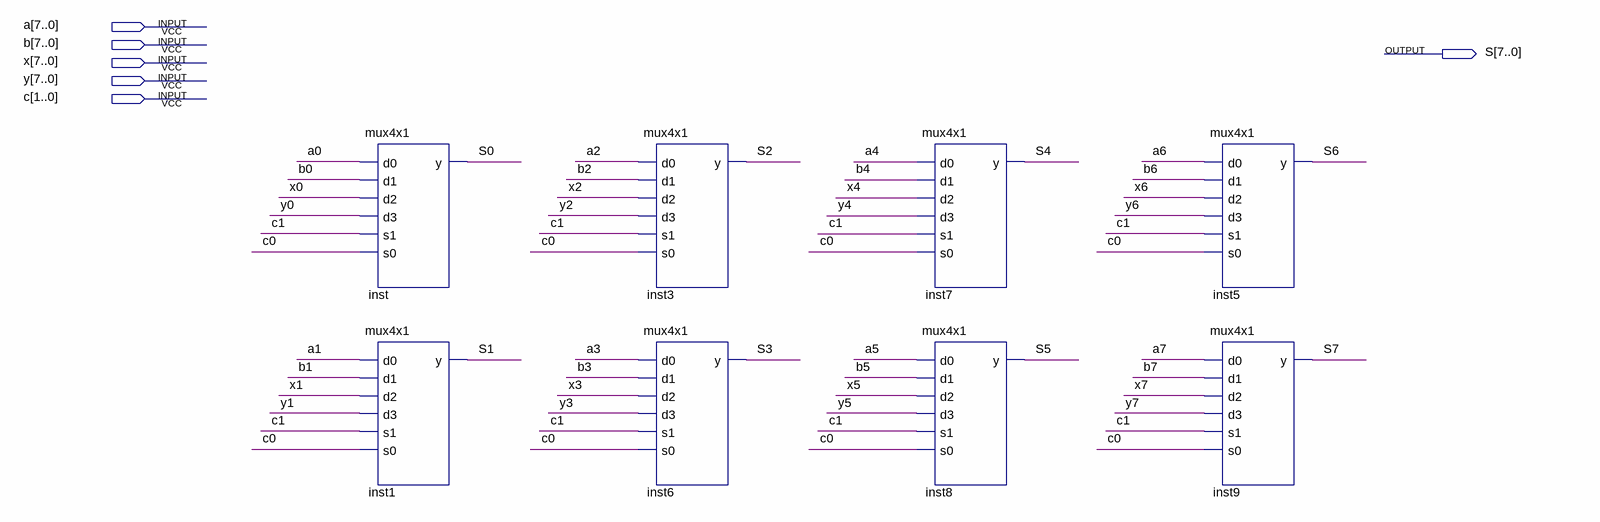
[diagram p0: schematic sheet]
// Quartus schematic mux4x1_8bits.bdf as structural Verilog: 8 symbols, 6 pins
module mux4x1_8bits (
  input  [7:0] a,
  input  [7:0] b,
  input  [7:0] x,
  input  [7:0] y,
  input  [1:0] c,
  output [7:0] S
);

  mux4x1 inst (.d0(a[0]), .d1(b[0]), .d2(x[0]), .d3(y[0]), .s1(c[1]), .s0(c[0]), .y(S[0]));
  mux4x1 inst1 (.d0(a[1]), .d1(b[1]), .d2(x[1]), .d3(y[1]), .s1(c[1]), .s0(c[0]), .y(S[1]));
  mux4x1 inst3 (.d0(a[2]), .d1(b[2]), .d2(x[2]), .d3(y[2]), .s1(c[1]), .s0(c[0]), .y(S[2]));
  mux4x1 inst6 (.d0(a[3]), .d1(b[3]), .d2(x[3]), .d3(y[3]), .s1(c[1]), .s0(c[0]), .y(S[3]));
  mux4x1 inst7 (.d0(a[4]), .d1(b[4]), .d2(x[4]), .d3(y[4]), .s1(c[1]), .s0(c[0]), .y(S[4]));
  mux4x1 inst8 (.d0(a[5]), .d1(b[5]), .d2(x[5]), .d3(y[5]), .s1(c[1]), .s0(c[0]), .y(S[5]));
  mux4x1 inst5 (.d0(a[6]), .d1(b[6]), .d2(x[6]), .d3(y[6]), .s1(c[1]), .s0(c[0]), .y(S[6]));
  mux4x1 inst9 (.d0(a[7]), .d1(b[7]), .d2(x[7]), .d3(y[7]), .s1(c[1]), .s0(c[0]), .y(S[7]));
endmodule
